# Altium project STM32L0_USB_TempSensor.PrjPcb
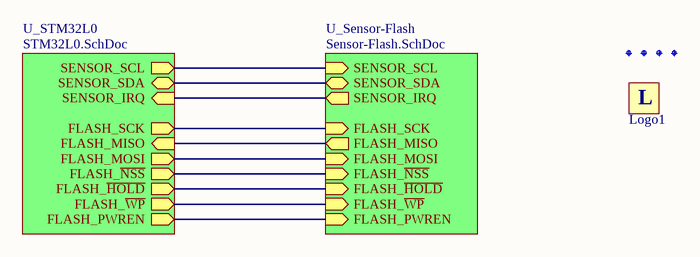
[diagram p0: STM32L0_USB_TempSensor.SchDoc]
3 sheets, 42 parts. Net scope: hierarchical (ports join the sheet entries above them; power ports are global).
Board file: STM32L0_USB_TempSensor.PcbDoc
Sheets:
  STM32L0_USB_TempSensor.SchDoc
    U_STM32L0 = STM32L0.SchDoc
    U_Sensor-Flash = Sensor-Flash.SchDoc

## Sheet STM32L0_USB_TempSensor.SchDoc: Block Diagram
size A4; SheetNumber: 1; SheetTotal: 3; SheetSize: A4

### Parts
Fid1  Fiducial mark  [Fiducial]  (value not drawn)  (no BOM)
Fid2  Fiducial mark  [Fiducial]  (value not drawn)  (no BOM)
Fid3  Fiducial mark  [Fiducial]  (value not drawn)  (no BOM)
Fid4  Fiducial mark  [Fiducial]  (value not drawn)  (no BOM)
Logo1  Logo symbol  [LOGO_YILDIZIOT]  (value not drawn)  (no BOM)

### Sub-sheets
U_Sensor-Flash = Sensor-Flash.SchDoc: FLASH_~{NSS} (in), FLASH_SCK (in), FLASH_MISO (out), FLASH_MOSI (in), FLASH_~{HOLD} (in), FLASH_~{WP} (in), SENSOR_SCL (in), SENSOR_SDA (bidir), SENSOR_IRQ (out), FLASH_PWREN (in)
U_STM32L0 = STM32L0.SchDoc: SENSOR_SCL (out), SENSOR_SDA (bidir), FLASH_~{NSS} (out), FLASH_SCK (out), FLASH_MISO (in), FLASH_MOSI (out), FLASH_~{HOLD} (out), FLASH_~{WP} (out), SENSOR_IRQ (in), FLASH_PWREN (out)

### Nets
NetIC1_1: sheet U_STM32L0/SENSOR_SCL, sheet U_Sensor-Flash/SENSOR_SCL
NetIC1_2: sheet U_STM32L0/SENSOR_IRQ, sheet U_Sensor-Flash/SENSOR_IRQ
NetIC1_6: sheet U_STM32L0/SENSOR_SDA, sheet U_Sensor-Flash/SENSOR_SDA
NetIC2_1: sheet U_STM32L0/FLASH_~{NSS}, sheet U_Sensor-Flash/FLASH_~{NSS}
NetIC2_2: sheet U_STM32L0/FLASH_MISO, sheet U_Sensor-Flash/FLASH_MISO
NetIC2_3: sheet U_STM32L0/FLASH_~{WP}, sheet U_Sensor-Flash/FLASH_~{WP}
NetIC2_5: sheet U_STM32L0/FLASH_MOSI, sheet U_Sensor-Flash/FLASH_MOSI
NetIC2_6: sheet U_STM32L0/FLASH_SCK, sheet U_Sensor-Flash/FLASH_SCK
NetIC2_7: sheet U_STM32L0/FLASH_~{HOLD}, sheet U_Sensor-Flash/FLASH_~{HOLD}
NetIC3_1: sheet U_STM32L0/FLASH_PWREN, sheet U_Sensor-Flash/FLASH_PWREN

### Notes on the sheet
- Title:
- Size:
- Project:
- Revision:
- Sheet
- of
- Date:
- YıLDıZ IoT
- Elperek Mahallesi
- Saray Sokak, No:12
- SAKARYA / TURKEY
- File:
- (in symbol Logo) L

### Library data of the parts
Fid1-Fid4 = Fiducial: Part Number: Fid-Mark; Artikkelnr Noca: N.A.; Manufacturer: *; Manufacturer Part Number: *; Datasheet: *; LatestRevisionDate: 2009-12-12; Pin Count: 1; Publisher: Nordic Semiconductor; Published: 2009-12-12; Value: *; Note: *; Supplier: *; Supplier part number: *; 2nd source Supplier: *; 2nd source part number: *; Footprint Doc: Fiducial; Artikkelnr Simpro: N.A.
Logo1 = Logo: Schematic symbol for Logo

## Sheet STM32L0.SchDoc: MCU
size A4; SheetNumber: 2; SheetTotal: 3; SheetSize: A4
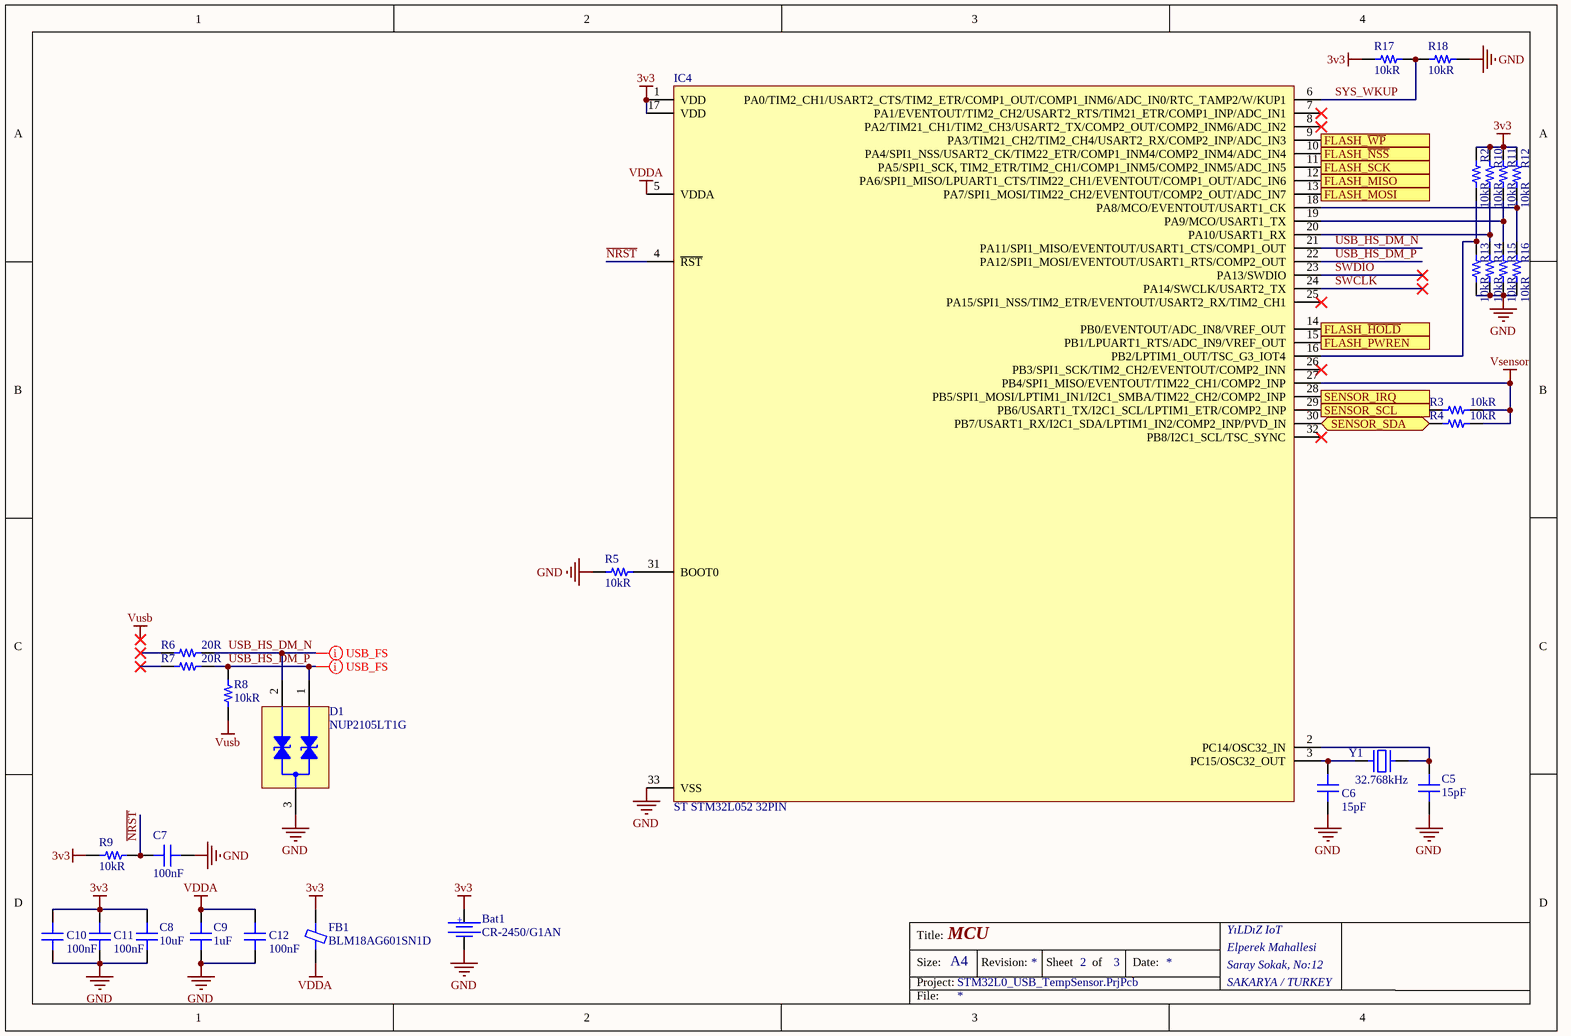
[diagram p1: STM32L0.SchDoc]

### Parts
Bat1  CR-2450/G1AN  [CR-2450/G1AN]
C5  15pF  [CAP 0603/1608]
C6  15pF  [CAP 0603/1608]
C7  100nF  [CAP 0603/1608]
C8  10uF  [CAP 0603/1608]
C9  1uF  [CAP 0603/1608]
C10  100nF  [CAP 0603/1608]
C11  100nF  [CAP 0603/1608]
C12  100nF  [CAP 0603/1608]
D1  NUP2105LT1G  [ON SEMI SOT-23-3]  (no BOM)
FB1  BLM18AG601SN1D  [FER 0603/1608]
IC4  ST STM32L052 32PIN  [ST VFQFN-33 5x5mm]
R2  10kR  [RES 0603/1608]
R3  10kR  [RES 0603/1608]
R4  10kR  [RES 0603/1608]
R5  10kR  [RES 0603/1608]
R6  20R  [RES 0603/1608]
R7  20R  [RES 0603/1608]
R8  10kR  [RES 0603/1608]
R9  10kR  [RES 0603/1608]
R10  10kR  [RES 0603/1608]
R11  10kR  [RES 0603/1608]
R12  10kR  [RES 0603/1608]
R13  10kR  [RES 0603/1608]
R14  10kR  [RES 0603/1608]
R15  10kR  [RES 0603/1608]
R16  10kR  [RES 0603/1608]
R17  10kR  [RES 0603/1608]
R18  10kR  [RES 0603/1608]
Y1  32.768kHz  [ABRACON ABS06]

### Ports
FLASH_MISO (in), FLASH_MOSI (out), FLASH_PWREN (out), FLASH_SCK (out), FLASH_~{HOLD} (out), FLASH_~{NSS} (out), FLASH_~{WP} (out), SENSOR_IRQ (in), SENSOR_SCL (out), SENSOR_SDA (bidir)

### Nets
3v3: Bat1.1 C8.2 C10.2 C11.2 FB1.2 IC4.1(VDD) IC4.17(VDD) R2.1 R9.2 R10.1 R11.1 R12.1 R17.1
GND: Bat1.2 C5.1 C6.1 C7.1 C8.1 C9.1 C10.1 C11.1 C12.1 D1.3(I/O_2) IC4.33(VSS) R5.1 R13.2 R14.2 R15.2 R16.2 R18.2
VDDA: C9.2 C12.2 FB1.1 IC4.5(VDDA)
Vsensor: IC4.27(PB4/SPI1_MISO/EVENTOUT/TIM22_CH1/COMP2_INP) R3.1 R4.1
Vusb: R8.1
~{NRST}: C7.2 IC4.4(~{RST}) R9.1
SWCLK: IC4.24(PA14/SWCLK/USART2_TX)
SWDIO: IC4.23(PA13/SWDIO)
SYS_WKUP: IC4.6(PA0/TIM2_CH1/USART2_CTS/TIM2_ETR/COMP1_OUT/COMP1_INM6/ADC_IN0/RTC_TAMP2/W/KUP1) R17.2 R18.1
USB_HS_DM_N: D1.2(GND) IC4.21(PA11/SPI1_MISO/EVENTOUT/USART1_CTS/COMP1_OUT) R6.1
USB_HS_DM_P: D1.1(I/O_1) IC4.22(PA12/SPI1_MOSI/EVENTOUT/USART1_RTS/COMP2_OUT) R7.1 R8.2
NetC5_2: C5.2 IC4.2(PC14/OSC32_IN) Y1.2
NetC6_2: C6.2 IC4.3(PC15/OSC32_OUT) Y1.1
NetIC1_1: IC4.29(PB6/USART1_TX/I2C1_SCL/LPTIM1_ETR/COMP2_INP) R3.2 ; port SENSOR_SCL
NetIC1_2: IC4.28(PB5/SPI1_MOSI/LPTIM1_IN1/I2C1_SMBA/TIM22_CH2/COMP2_INP) ; port SENSOR_IRQ
NetIC1_6: IC4.30(PB7/USART1_RX/I2C1_SDA/LPTIM1_IN2/COMP2_INP/PVD_IN) R4.2 ; port SENSOR_SDA
NetIC2_1: IC4.10(PA4/SPI1_NSS/USART2_CK/TIM22_ETR/COMP1_INM4/COMP2_INM4/ADC_IN4) ; port FLASH_~{NSS}
NetIC2_2: IC4.12(PA6/SPI1_MISO/LPUART1_CTS/TIM22_CH1/EVENTOUT/COMP1_OUT/ADC_IN6) ; port FLASH_MISO
NetIC2_3: IC4.9(PA3/TIM21_CH2/TIM2_CH4/USART2_RX/COMP2_INP/ADC_IN3) ; port FLASH_~{WP}
NetIC2_5: IC4.13(PA7/SPI1_MOSI/TIM22_CH2/EVENTOUT/COMP2_OUT/ADC_IN7) ; port FLASH_MOSI
NetIC2_6: IC4.11(PA5/SPI1_SCK,_TIM2_ETR/TIM2_CH1/COMP1_INM5/COMP2_INM5/ADC_IN5) ; port FLASH_SCK
NetIC2_7: IC4.14(PB0/EVENTOUT/ADC_IN8/VREF_OUT) ; port FLASH_~{HOLD}
NetIC3_1: IC4.15(PB1/LPUART1_RTS/ADC_IN9/VREF_OUT) ; port FLASH_PWREN
NetIC4_16: IC4.16(PB2/LPTIM1_OUT/TSC_G3_IOT4) R2.2 R13.1
NetIC4_18: IC4.18(PA8/MCO/EVENTOUT/USART1_CK) R12.2 R16.1
NetIC4_19: IC4.19(PA9/MCO/USART1_TX) R11.2 R15.1
NetIC4_20: IC4.20(PA10/USART1_RX) R10.2 R14.1
NetIC4_31: IC4.31(BOOT0) R5.2

Not connected (* = marked no-connect by the designer): IC4 7(PA1/EVENTOUT/TIM2_CH2/USART2_RTS/TIM21_ETR/COMP1_INP/ADC_IN1)* 8(PA2/TIM21_CH1/TIM2_CH3/USART2_TX/COMP2_OUT/COMP2_INM6/ADC_IN2)* 25(PA15/SPI1_NSS/TIM2_ETR/EVENTOUT/USART2_RX/TIM2_CH1)* 26(PB3/SPI1_SCK/TIM2_CH2/EVENTOUT/COMP2_INN)* 32(PB8/I2C1_SCL/TSC_SYNC)*; R6 2*; R7 2*

### Layout directives
differential pair; differential pair class USB_FS; rule Differential Pairs Routing [Pref Gap = 0.254mm    Min Gap  = 0.127mm    Max Gap  = 0.254mmPref Width = 0.127mm    Min Width  = 0.127mm    Max Width  = 0.381mm]; rule Matched Net Lengths [Tolerance = 100mil]: USB_HS_DM_N, USB_HS_DM_P

### Notes on the sheet
- Labels drawn without touching a wire or pin: Vusb
- Title:
- Size:
- Project:
- Revision:
- Sheet
- of
- Date:
- YıLDıZ IoT
- Elperek Mahallesi
- Saray Sokak, No:12
- SAKARYA / TURKEY
- File:
- (in symbol Battery) +

### Library data of the parts
Bat1 = Battery: Bat Holder; Manufacturer: Panasonic BSG; Output Voltage: 3V; Capacity: 620mAh; Chemistry/Technology: Lithium; Number of Cells: 1; Supplier 1: Digi-Key; Supplier Part Number 1: P661-ND; Manufacturer Part Number: CR-2450/G1AN; Stock 1: 10737; Pricing 1: 1 = 1,76000, 20 = 1,46300, 40 = 1,35975, 100 = 1,21560, 300 = 1,13323, 500 = 1,07140, 1000 = 1,00960, 2500 = 0,94092 (USD); RoHS: Yes; Mount: Through Hole; Weight: 6.3g; Contact Plating: Tin; Min Operating Temperature: -30°C; Max Operating Temperature: 60°C; Termination: PC Pin; Package Quantity: 200; Orientation: Horizontal; Packaging: Bulk; Voltage Rating: 3V; Diameter: 24.5mm; Length: 24.6mm; Height: 5mm; Depth: 24.6mm; Lead Free: Lead Free; ComponentLink1URL: https://datasheet.ciiva.com/2/aaa4000de105-2936.pdf?src-supplier=Digi-Key; ComponentLink1Description: https://datasheet.ciiva.com/2/aaa4000de105-2936.pdf?src-supplier=Digi-Key; ComponentLink2URL: https://datasheet.ciiva.com/24073/aaa4000de105-259051-24073605.pdf?src-supplier=Mouser; ComponentLink2Description: https://datasheet.ciiva.com/24073/aaa4000de105-259051-24073605.pdf?src-supplier=Mouser
C5 C6 = Capacitor - Ceramic: Ceramic, SMT Capacitor; Manufacturer: Walsin Technologies; Manufacturer Part Number: 0603N150J500CT; Tolerance: 5%; Dielectric: C0G; Voltage Rating: 50V; Supplier 1: Digi-Key; Supplier Part Number 1: 1292-1487-1-ND; Stock 1: 219118; Pricing 1: 1 = 0,10000, 10 = 0,03300, 100 = 0,01490, 500 = 0,01062, 1000 = 0,00835 (USD); RoHS: Yes; Case/Package: 0603; Case Code (Metric): 1608; Case Code (Imperial): 0603; Min Operating Temperature: -55°C; Max Operating Temperature: 125°C; Packaging: Tape and Reel; Capacitance: 15pF; Voltage Rating (DC): 50V; Length: 1.6mm; Depth: 0.8mm; REACH SVHC: Unknown; ComponentLink1URL: http://www.farnell.com/datasheets/1958513.pdf?src-supplier=Farnell; ComponentLink1Description: http://www.farnell.com/datasheets/1958513.pdf?src-supplier=Farnell; ComponentLink2URL: http://www.farnell.com/datasheets/2340522.pdf?src-supplier=Farnell; ComponentLink2Description: http://www.farnell.com/datasheets/2340522.pdf?src-supplier=Farnell; ComponentLink3URL: http://components.arrow.com/part/dataview/0323_03468609?src-supplier=Arrow+Europe; ComponentLink3Description: http://components.arrow.com/part/dataview/0323_03468609?src-supplier=Arrow+Europe; ComponentLink4URL: http://www.farnell.com/datasheets/1958513.pdf?src-supplier=Element14; ComponentLink4Description: http://www.farnell.com/datasheets/1958513.pdf?src-supplier=Element14
C7 C10-C12 = Capacitor - Ceramic: Ceramic, SMT Capacitor; Manufacturer: Samsung; Manufacturer Part Number: CL10B104JB8NNNC; Tolerance: 5%; Voltage Rating: 50V; Dielectric: X7R; Supplier 1: Digi-Key; Supplier Part Number 1: 1276-1033-1-ND; Stock 1: 223594; Pricing 1: 1 = 0,10000, 10 = 0,05300, 100 = 0,02350, 500 = 0,01680, 1000 = 0,01320 (USD); RoHS: Yes; Mount: Surface Mount; Case/Package: 0603; Case Code (Metric): 1608; Case Code (Imperial): 0603; Material: Ceramic; Contact Plating: Tin; Min Operating Temperature: -55°C; Max Operating Temperature: 125°C; Packaging: Tape and Reel; Package Quantity: 1; Capacitance: 100nF; Voltage: 50V; Length: 1.6mm; Height: 0.8mm; Width: 0.031inch; Thickness: 0.035inch; Depth: 0.8mm; Radiation Hardening: No; ComponentLink1URL: https://media.digikey.com/pdf/Data%20Sheets/Samsung%20PDFs/CL_Series_MLCC_ds.pdf?src-supplier=Digi-Key; ComponentLink1Description: https://media.digikey.com/pdf/Data%20Sheets/Samsung%20PDFs/CL_Series_MLCC_ds.pdf?src-supplier=Digi-Key; ComponentLink2URL: https://www.verical.com/server-webapp/html/getDatasheet?partID=359321&src-supplier=Verical; ComponentLink2Description: https://www.verical.com/server-webapp/html/getDatasheet?partID=359321&src-supplier=Verical; ComponentLink3URL: http://www1.futureelectronics.com/doc/SAMSUNG/CL10B104JB8NNNC.pdf?src-supplier=Future+Electronics; ComponentLink3Description: http://www1.futureelectronics.com/doc/SAMSUNG/CL10B104JB8NNNC.pdf?src-supplier=Future+Electronics; ComponentLink4URL: https://produktinfo.conrad.com/datenblaetter/450000-474999/456613-da-01-en-VS_KONDENSATOR_0603.pdf?src-supplier=Conrad; ComponentLink4Description: https://produktinfo.conrad.com/datenblaetter/450000-474999/456613-da-01-en-VS_KONDENSATOR_0603.pdf?src-supplier=Conrad
C8 = Capacitor - Ceramic: Ceramic, SMT Capacitor; Manufacturer: Kyocera AVX; Manufacturer Part Number: 0603ZD106KAT2A; Dielectric: X5R; Voltage Rating (DC): 10V; Tolerance: 10%; ComponentLink1URL: https://datasheet.ciiva.com/25713/cl10a475mq8nnnc-25713301.pdf?src-supplier=Digi-Key; ComponentLink1Description: https://datasheet.ciiva.com/25713/cl10a475mq8nnnc-25713301.pdf?src-supplier=Digi-Key; ComponentLink2URL: https://datasheet.ciiva.com/26838/getdatasheetpartid-358407-26838391.pdf?src-supplier=Verical; ComponentLink2Description: https://datasheet.ciiva.com/26838/getdatasheetpartid-358407-26838391.pdf?src-supplier=Verical; ComponentLink3URL: https://datasheet.ciiva.com/16437/cl05b104kq5nnnc-16437323.pdf?src-supplier=Future+Electronics; ComponentLink3Description: https://datasheet.ciiva.com/16437/cl05b104kq5nnnc-16437323.pdf?src-supplier=Future+Electronics; Supplier 1: Digi-Key; Supplier Part Number 1: 478-10766-1-ND; Stock 1: 32713; Pricing 1: 1 = 0,13000, 10 = 0,09200 (USD); RoHS: No; Case/Package: 0603; Capacitance: 10uF; ComponentLink4URL: http://datasheets.avx.com/cx5r.pdf?src-supplier=Digi-Key; ComponentLink4Description: http://datasheets.avx.com/cx5r.pdf?src-supplier=Digi-Key
C9 = Capacitor - Ceramic: Ceramic, SMT Capacitor; Manufacturer: Samsung; Manufacturer Part Number: CL10A105KP8NNNC; Tolerance: 10%; Voltage Rating: 10V; Dielectric: X5R; Supplier 1: Digi-Key; Supplier Part Number 1: 1276-1182-1-ND; Stock 1: 4590831; Pricing 1: 1 = 0,10000, 10 = 0,03800, 100 = 0,01680, 500 = 0,01200, 1000 = 0,00943 (USD); RoHS: Yes; Mount: Surface Mount; Case/Package: 0603; Case Code (Metric): 1608; Case Code (Imperial): 0603; Contact Plating: Tin; Min Operating Temperature: -55°C; Max Operating Temperature: 85°C; Packaging: Tape and Reel; Package Quantity: 1; Capacitance: 1uF; Voltage: 10V; Length: 1.6mm; Height: 0.8mm; Width: 0.031inch; Thickness: 0.035inch; Depth: 0.8mm; Radiation Hardening: No; ComponentLink1URL: https://datasheet.ciiva.com/15195/getdatasheetpartid-358616-15195708.pdf?src-supplier=Verical; ComponentLink1Description: https://datasheet.ciiva.com/15195/getdatasheetpartid-358616-15195708.pdf?src-supplier=Verical; ComponentLink2URL: https://datasheet.ciiva.com/16358/cl05b104kq5nnnc-16358431.pdf?src-supplier=Future+Electronics; ComponentLink2Description: https://datasheet.ciiva.com/16358/cl05b104kq5nnnc-16358431.pdf?src-supplier=Future+Electronics
D1 = NUP2105LT1G: TVS DIODE 24V 44V SOT23-3; Manufacturer: ON Semiconductor; Bidirectional Channels: 2; Capacitance @ Frequency: 30pF @ 1MHz; Current - Peak Pulse (10/1000µs): 8A (8/20µs); Power Line Protection: No; Power - Peak Pulse: 350W; Type: Zener; Voltage - Breakdown (Min): 26.2V; Voltage - Reverse Standoff (Typ): 24V (Min); Manufacturer Part Number: NUP2105LT1G; Applications: General Purpose; ComponentLink1Description: Datasheet; ComponentLink1URL: http://www.onsemi.com/pub/Collateral/NUP2105L-D.PDF; ComponentLink2Description: DigiKey Link; ComponentLink2URL: http://digikey.com/product-detail/en/on-semiconductor/NUP2105LT1G/NUP2105LT1GOSCT-ND/1485001; Device Package: TO-236-3, SC-59, SOT-23-3; LastUpdated: 30.03.2020 16:33:57; Lifecycle Status: Active; Minimum Order: 1; Mounting Type: Surface Mount; Operating Temperature: -55°C ~ 150°C (TJ); Package / Case: TO-236-3, SC-59, SOT-23-3; Packaging: TapeAndReel; PartId: 10506; Part Status: Active; Price: 0.09; Series: -; Supplier 1: DigiKey; Supplier Part Number 1: NUP2105LT1GOSCT-ND; Supplier Device Package: SOT-23-3 (TO-236); Voltage - Clamping (Max) @ Ipp: 44V
FB1 = Ferrite Chip: SMT Ferrite Chip; Manufacturer: Murata; Material: Steel; Frequency: 100MHz; Tolerance: 25%; Impedance: 600R; Max Current Rating: 500mA; Number of Lines: 1; DC Resistance (DCR): 380mR; Shielding: Unshielded; Supplier 1: Digi-Key; Supplier Part Number 1: 490-1014-1-ND; Manufacturer Part Number: BLM18AG601SN1D; Stock 1: 1151376; Pricing 1: 1 = 0,10000, 10 = 0,07900, 25 = 0,07200, 50 = 0,06480, 100 = 0,04760, 250 = 0,03460, 500 = 0,03170, 1000 = 0,02738 (USD); RoHS: Yes; Case/Package: 0603; Number of Pins: 2; Weight: 7.1E-05oz; Core Material: Ferrite; Case Code (Metric): 1608; Case Code (Imperial): 0603; Min Operating Temperature: -55°C; Max Operating Temperature: 125°C; Package Quantity: 1; Packaging: Tape and Reel; Current Rating: 500mA; Termination: SMD/SMT; Max DC Current: 500mA; Test Frequency: 100MHz; DC Current: 500mA; Military Standard: Not; Number of Circuits: 1; Length: 1.6mm; Height: 0.8mm; Width: 0.8mm; Depth: 0.8mm; Radiation Hardening: No; Lead Free: Lead Free; REACH SVHC: No SVHC; ComponentLink1URL: https://datasheet.ciiva.com/19460/1844766-19460213.pdf?src-supplier=Jameco; ComponentLink1Description: https://datasheet.ciiva.com/19460/1844766-19460213.pdf?src-supplier=Jameco; ComponentLink2URL: https://datasheet.ciiva.com/29347/442309-da-01-en-chip-drossel-0603-600r-500ma-1-6x0-8mm-29347900.pdf?src-supplier=Conrad; ComponentLink2Description: https://datasheet.ciiva.com/29347/442309-da-01-en-chip-drossel-0603-600r-500ma-1-6x0-8mm-29347900.pdf?src-supplier=Conrad; ComponentLink3URL: https://datasheet.ciiva.com/41449/001172228-da-01-en-drossel-0603-600r-1-6x0-8mm-4000st-41449517.pdf?src-supplier=Conrad; ComponentLink3Description: https://datasheet.ciiva.com/41449/001172228-da-01-en-drossel-0603-600r-1-6x0-8mm-4000st-41449517.pdf?src-supplier=Conrad; ComponentLink4URL: https://datasheet.ciiva.com/1012/l0110s0100blm18a-1012018.pdf?src-supplier=Digi-Key; ComponentLink4Description: https://datasheet.ciiva.com/1012/l0110s0100blm18a-1012018.pdf?src-supplier=Digi-Key; ComponentLink5URL: https://datasheet.ciiva.com/1012/l0110s0100blm18a-1012019.pdf?src-supplier=Digi-Key; ComponentLink5Description: https://datasheet.ciiva.com/1012/l0110s0100blm18a-1012019.pdf?src-supplier=Digi-Key; ComponentLink6URL: https://datasheet.ciiva.com/1466/1756147-1466934.pdf?src-supplier=Element14; ComponentLink6Description: https://datasheet.ciiva.com/1466/1756147-1466934.pdf?src-supplier=Element14; ComponentLink7URL: https://datasheet.ciiva.com/3081/l0110s0100blm18a-3081613.pdf?src-supplier=Avnet; ComponentLink7Description: https://datasheet.ciiva.com/3081/l0110s0100blm18a-3081613.pdf?src-supplier=Avnet; ComponentLink8URL: https://datasheet.ciiva.com/1012/l0110s0100blm18a-1012017.pdf?src-supplier=Digi-Key; ComponentLink8Description: https://datasheet.ciiva.com/1012/l0110s0100blm18a-1012017.pdf?src-supplier=Digi-Key; ComponentLink9URL: https://datasheet.ciiva.com/1466/1756147-1466933.pdf?src-supplier=Element14; ComponentLink9Description: https://datasheet.ciiva.com/1466/1756147-1466933.pdf?src-supplier=Element14; ComponentLink10URL: https://datasheet.ciiva.com/16210/l0110s0100blm18a-16210006.pdf?src-supplier=Future+Electronics; ComponentLink10Description: https://datasheet.ciiva.com/16210/l0110s0100blm18a-16210006.pdf?src-supplier=Future+Electronics
IC4 = ST STM32L052 32PIN: Manufacturer: STMicroelectronics; Manufacturer Part Number: STM32L052K6U6; Frequency: 32MHz; Oscillator Type: Internal; Data Bus Width: 32b; Number of Programmable I/O: 27; Watchdog Timer: Yes; Peripherals: Brown-out Detect/Reset,POR,PWM,WDT,DMA; Memory Type: FLASH; Memory Size: 32KB; RAM Size: 8KB; Max Power Dissipation: 351mW; Interface: I2C,SPI,USB,IrDA,UART,USART,I2S; Number of Timers/Counters: 5; Core Architecture: ARM; Supplier 1: Digi-Key; Supplier Part Number 1: 497-17492-ND; Stock 1: 1850; Pricing 1: 1 = 3,25000, 10 = 2,91800, 25 = 2,75840, 100 = 2,39070, 250 = 2,26812, 500 = 2,03516, 1000 = 1,71640, 2500 = 1,63058, 5000 = 1,56928 (USD); RoHS: Yes; Case/Package: UFQFPN; Min Operating Temperature: -40°C; Max Operating Temperature: 85°C; Max Frequency: 32MHz; Package Quantity: 2940; Packaging: Tray; Number of I/Os: 27; ComponentLink1URL: https://datasheet.ciiva.com/48492/dm00108217-48492190.pdf?src-supplier=Avnet; ComponentLink1Description: https://datasheet.ciiva.com/48492/dm00108217-48492190.pdf?src-supplier=Avnet
R2-R5 R8-R18 = Resistor_Chip: Ceramic, SMT Capacitor; Manufacturer: Stackpole Electronics; Manufacturer Part Number: RNCP0603FTD10K0; Tolerance: 1%; Max Power Dissipation: 125mW; Temperature Coefficient: 100ppm/°C; Supplier 1: Digi-Key; Supplier Part Number 1: RNCP0603FTD10K0CT-ND; Stock 1: 183083; Pricing 1: 1 = 0,10000, 10 = 0,06700, 100 = 0,02730, 1000 = 0,01224, 2500 = 0,01063 (USD); RoHS: Yes; Mount: Surface Mount; Case/Package: 0603; Case Code (Metric): 1608; Case Code (Imperial): 0603; Contact Plating: Matte,Tin; Min Operating Temperature: -55°C; Max Operating Temperature: 155°C; Packaging: Tape and Reel; Resistance: 10kR; Composition: Thin Film; Number of Terminations: 2; Features: Anti-Sulfur,Moisture Resistant; Length: 0.059inch; Height: 0.02inch; Width: 0.031inch; Radiation Hardening: No; Lead Free: Lead Free
R6 R7 = Resistor_Chip: Ceramic, SMT Capacitor; Manufacturer: Panasonic; Manufacturer Part Number: ERJ3EKF20R0V; Power Rating: 100mW; Tolerance: 1%; Voltage Rating: 75V; Temperature Coefficient: 100ppm/°C; Voltage Rating (DC): 50V; Supplier 1: Digi-Key; Supplier Part Number 1: P20.0HCT-ND; Stock 1: 1013618; Pricing 1: 1 = 0,10000, 10 = 0,06500, 100 = 0,02640, 1000 = 0,01186, 2500 = 0,01029 (USD); RoHS: Yes; Mount: Surface Mount; Case/Package: 0603; Case Code (Metric): 1608; Case Code (Imperial): 0603; Contact Plating: Tin; Min Operating Temperature: -55°C; Max Operating Temperature: 155°C; Packaging: Tape and Reel; Resistance: 20R; Package Quantity: 1; Composition: Thick Film; Number of Terminations: 2; Termination: SMD/SMT; Military Standard: Not; Max Power Dissipation: 100mW; Features: Automotive AEC-Q200; Length: 1.6mm; Height: 0.45mm; Width: 0.031inch; Depth: 0.8mm; Radiation Hardening: No; REACH SVHC: No SVHC; Lead Free: Lead Free; ComponentLink1URL: http://industrial.panasonic.com/www-data/pdf/AOA0000/AOA0000CE2.pdf; ComponentLink1Description: http://industrial.panasonic.com/www-data/pdf/AOA0000/AOA0000CE2.pdf; ComponentLink2URL: https://www.alliedelec.com/m/d/623f45ff1957d936ff56d46fd1c28cac.pdf; ComponentLink2Description: https://www.alliedelec.com/m/d/623f45ff1957d936ff56d46fd1c28cac.pdf; ComponentLink3URL: http://www.jameco.com/Jameco/Products/ProdDS/1987732.pdf; ComponentLink3Description: http://www.jameco.com/Jameco/Products/ProdDS/1987732.pdf; ComponentLink4URL: http://www.farnell.com/datasheets/1678782.pdf; ComponentLink4Description: http://www.farnell.com/datasheets/1678782.pdf; ComponentLink5URL: http://www.farnell.com/datasheets/1911175.pdf; ComponentLink5Description: http://www.farnell.com/datasheets/1911175.pdf; ComponentLink6URL: http://www.mouser.com/ds/2/315/AOA0000CE2-37512.pdf; ComponentLink6Description: http://www.mouser.com/ds/2/315/AOA0000CE2-37512.pdf
Y1 = ABS06-32.768KHZ-1-T: CRYSTAL 32.7680KHZ 12.5PF SMD; Manufacturer: Abracon LLC; Frequency Tolerance: 10ppm; ESR: 90 kOhm; Operating Mode: Fundamental; ESR (Equivalent Series Resistance): 90kR; Manufacturer Part Number: ABS06-32.768KHZ-1-T; PartId: 8532; Supplier 1: Digi-Key; ComponentLink1Description: Datasheet; ComponentLink1URL: http://www.abracon.com/Resonators/ABS06.pdf; ComponentLink2Description: Digi-Key Listing; ComponentLink2URL: http://www.digikey.com/product-detail/en/ABS06-32.768KHZ-1-T/535-10248-2-ND/2217994; Type: kHz Crystal (Tuning Fork); Device Package: 2-SMD; Frequency: 32.768kHz; Frequency Stability: -; Load Capacitance: 12.5pF; Supplier Part Number 1: 535-10248-1-ND; Stock 2: 63513; Pricing 1: 1 = 0,80000, 10 = 0,70800, 50 = 0,66220, 100 = 0,58520, 500 = 0,55440, 1000 = 0,46200 (USD); RoHS: Yes; Mount: Surface Mount; Case/Package: CSMD; Number of Pins: 2; Min Operating Temperature: -40°C; Max Operating Temperature: 85°C; Tolerance: 10ppm; Packaging: Tape and Reel; Package Quantity: 3000; Termination: SMD/SMT; Series Resistance: 90kR; Length: 2mm; Height: 0.024inch; Width: 1.2mm; Depth: 1.2mm; Radiation Hardening: No; REACH SVHC: No SVHC; Lead Free: Lead Free; ComponentLink3URL: https://datasheet.ciiva.com/15116/getdatasheetpartid-721079-15116832.pdf?src-supplier=Verical; ComponentLink3Description: https://datasheet.ciiva.com/15116/getdatasheetpartid-721079-15116832.pdf?src-supplier=Verical; ComponentLink4URL: https://datasheet.ciiva.com/7998/abs06-7998658.pdf?src-supplier=Element14; ComponentLink4Description: https://datasheet.ciiva.com/7998/abs06-7998658.pdf?src-supplier=Element14; ComponentLink5URL: https://datasheet.ciiva.com/1357/1796520-1357315.pdf?src-supplier=Element14; ComponentLink5Description: https://datasheet.ciiva.com/1357/1796520-1357315.pdf?src-supplier=Element14; ComponentLink6URL: https://datasheet.ciiva.com/28508/1912788-28508597.pdf?src-supplier=Element14; ComponentLink6Description: https://datasheet.ciiva.com/28508/1912788-28508597.pdf?src-supplier=Element14; ComponentLink7URL: https://datasheet.ciiva.com/856/abs06-856604.pdf?src-supplier=Digi-Key; ComponentLink7Description: https://datasheet.ciiva.com/856/abs06-856604.pdf?src-supplier=Digi-Key; ComponentLink8URL: https://datasheet.ciiva.com/3176/abs06-3176156.pdf?src-supplier=Avnet; ComponentLink8Description: https://datasheet.ciiva.com/3176/abs06-3176156.pdf?src-supplier=Avnet; ComponentLink9URL: https://datasheet.ciiva.com/856/abs06-856605.pdf?src-supplier=Digi-Key; ComponentLink9Description: https://datasheet.ciiva.com/856/abs06-856605.pdf?src-supplier=Digi-Key; ComponentLink10URL: https://datasheet.ciiva.com/856/abs06-856606.pdf?src-supplier=Digi-Key; ComponentLink10Description: https://datasheet.ciiva.com/856/abs06-856606.pdf?src-supplier=Digi-Key

## Sheet Sensor-Flash.SchDoc: Sensor & Flash
size A4; SheetNumber: 3; SheetTotal: 3; SheetSize: A4
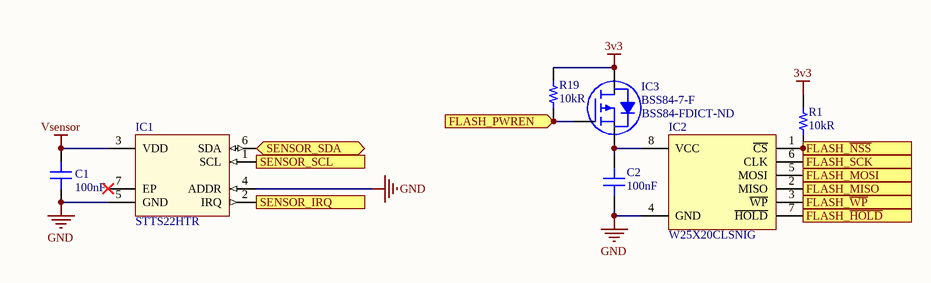
[diagram p2: Sensor-Flash.SchDoc]

### Parts
C1  100nF  [CAP 0603/1608]
C2  100nF  [CAP 0603/1608]
IC1  STTS22HTR  [ST UDFN-6 2x2x0.5]
IC2  W25X20CLSNIG  [WINBOND SOIC-8 208MIL WIDE]
IC3  BSS84-7-F  Supplier Part Number 1: BSS84-FDICT-ND  [DIODES SOT-23-3]
R1  10kR  [RES 0603/1608]
R19  10kR  [RES 0603/1608]

### Ports
FLASH_MISO (out), FLASH_MOSI (in), FLASH_PWREN (in), FLASH_SCK (in), FLASH_~{HOLD} (in), FLASH_~{NSS} (in), FLASH_~{WP} (in), SENSOR_IRQ (out), SENSOR_SCL (in), SENSOR_SDA (bidir)

### Nets
3v3: IC3.3(D) R1.2 R19.2
GND: C1.1 C2.2 IC1.4(ADDR) IC1.5(GND) IC2.4(GND)
Vsensor: C1.2 IC1.3(VDD)
NetC2_1: C2.1 IC2.8(VCC) IC3.2(S)
NetIC1_1: IC1.1(SCL) ; port SENSOR_SCL
NetIC1_2: IC1.2(IRQ) ; port SENSOR_IRQ
NetIC1_6: IC1.6(SDA) ; port SENSOR_SDA
NetIC2_1: IC2.1(~{CS}) R1.1 ; port FLASH_~{NSS}
NetIC2_2: IC2.2(MISO) ; port FLASH_MISO
NetIC2_3: IC2.3(~{WP}) ; port FLASH_~{WP}
NetIC2_5: IC2.5(MOSI) ; port FLASH_MOSI
NetIC2_6: IC2.6(CLK) ; port FLASH_SCK
NetIC2_7: IC2.7(~{HOLD}) ; port FLASH_~{HOLD}
NetIC3_1: IC3.1(G) R19.1 ; port FLASH_PWREN

Not connected (* = marked no-connect by the designer): IC1 7(EP)*

### Notes on the sheet
- Title:
- Size:
- Project:
- Revision:
- Sheet
- of
- Date:
- YıLDıZ IoT
- Elperek Mahallesi
- Saray Sokak, No:12
- SAKARYA / TURKEY
- File:

### Library data of the parts
C1 C2 = Capacitor - Ceramic: as C7 on sheet STM32L0; Supplier 1: Digi-Key; Supplier Part Number 1: 1276-1033-1-ND; RoHS: Yes; Mount: Surface Mount; Case/Package: 0603; Case Code (Metric): 1608; Case Code (Imperial): 0603; Material: Ceramic; Contact Plating: Tin; Min Operating Temperature: -55°C; Max Operating Temperature: 125°C; Packaging: Tape and Reel; Package Quantity: 1; Capacitance: 100nF; Voltage: 50V; Length: 1.6mm; Height: 0.8mm; Width: 0.031inch; Thickness: 0.035inch; Depth: 0.8mm; Radiation Hardening: No
  C1: Stock 1: 223594; Pricing 1: 1 = 0,10000, 10 = 0,05300, 100 = 0,02350, 500 = 0,01680, 1000 = 0,01320 (USD); ComponentLink1URL: https://media.digikey.com/pdf/Data%20Sheets/Samsung%20PDFs/CL_Series_MLCC_ds.pdf?src-supplier=Digi-Key; ComponentLink1Description: https://media.digikey.com/pdf/Data%20Sheets/Samsung%20PDFs/CL_Series_MLCC_ds.pdf?src-supplier=Digi-Key; ComponentLink2URL: https://www.verical.com/server-webapp/html/getDatasheet?partID=359321&src-supplier=Verical; ComponentLink2Description: https://www.verical.com/server-webapp/html/getDatasheet?partID=359321&src-supplier=Verical; ComponentLink3URL: http://www1.futureelectronics.com/doc/SAMSUNG/CL10B104JB8NNNC.pdf?src-supplier=Future+Electronics; ComponentLink3Description: http://www1.futureelectronics.com/doc/SAMSUNG/CL10B104JB8NNNC.pdf?src-supplier=Future+Electronics; ComponentLink4URL: https://produktinfo.conrad.com/datenblaetter/450000-474999/456613-da-01-en-VS_KONDENSATOR_0603.pdf?src-supplier=Conrad; ComponentLink4Description: https://produktinfo.conrad.com/datenblaetter/450000-474999/456613-da-01-en-VS_KONDENSATOR_0603.pdf?src-supplier=Conrad
  C2: Stock 1: 305374; Pricing 1: 1 = 0,10000, 10 = 0,04800, 100 = 0,02160, 500 = 0,01540, 1000 = 0,01210 (USD); ComponentLink1URL: https://datasheet.ciiva.com/25793/cl10b104jb8nnnc-25793394.pdf?src-supplier=Digi-Key; ComponentLink1Description: https://datasheet.ciiva.com/25793/cl10b104jb8nnnc-25793394.pdf?src-supplier=Digi-Key; ComponentLink2URL: https://datasheet.ciiva.com/26838/getdatasheetpartid-359321-26838402.pdf?src-supplier=Verical; ComponentLink2Description: https://datasheet.ciiva.com/26838/getdatasheetpartid-359321-26838402.pdf?src-supplier=Verical; ComponentLink3URL: https://datasheet.ciiva.com/16498/cl10b104jb8nnnc-16498485.pdf?src-supplier=Future+Electronics; ComponentLink3Description: https://datasheet.ciiva.com/16498/cl10b104jb8nnnc-16498485.pdf?src-supplier=Future+Electronics; ComponentLink4URL: https://datasheet.ciiva.com/29199/456613-da-01-en-vs-kondensator-0603-29199008.pdf?src-supplier=Conrad; ComponentLink4Description: https://datasheet.ciiva.com/29199/456613-da-01-en-vs-kondensator-0603-29199008.pdf?src-supplier=Conrad
IC1 = ST STTS22HTR: Low-voltage, ultra-low-power, 0.5 °C accuracy I²C/SMBus 3.0 temperature sensor; Manufacturer_Name: STMicroelectronics; Datasheet Link: https://www.mouser.com/datasheet/2/389/stts22h-1663205.pdf; Height: 0.55mm; Manufacturer_Part_Number: STTS22HTR; Mouser Part Number: 511-STTS22HTR; Mouser Price/Stock: https://www.mouser.co.uk/ProductDetail/STMicroelectronics/STTS22HTR?qs=%252B6g0mu59x7LCfjXXPvLkpg%3D%3D; RS Part Number: 1947647P; RS Price/Stock: http://uk.rs-online.com/web/p/products/1947647P; Supplier 1: Digi-Key; Supplier Part Number 1: 497-STTS22HCT-ND; Manufacturer: STMicroelectronics; Manufacturer Part Number: STTS22HTR; Stock 1: 5772; Pricing 1: 1 = 1,53000, 10 = 1,37200, 25 = 1,30200, 100 = 1,06950, 250 = 0,99976, 500 = 0,88350, 1000 = 0,69750 (USD); RoHS: No
IC2 = WINBOND FLASH SPI 8PIN: Address Bus Width: 24b; Density: 2Mb; Interface: SPI,Serial; Number of Words: 256000; Max Supply Voltage: 3.6V; Min Supply Voltage: 2.3V; Nominal Supply Current: 14mA; Access Time: 8ns; Memory Type: FLASH; Frequency: 50MHz; Sync/Async: Synchronous; ComponentLink1URL: http://www.winbond.com/resource-files/w25q128jv_dtr%20revc%2003272018%20plus.pdf?src-supplier=Digi-Key; ComponentLink1Description: http://www.winbond.com/resource-files/w25q128jv_dtr%20revc%2003272018%20plus.pdf?src-supplier=Digi-Key; Supplier 1: Digi-Key; Supplier Part Number 1: W25X20CLSNIG-ND; Manufacturer: Winbond; Manufacturer Part Number: W25X20CLSNIG; Stock 1: 12189; Pricing 1: 1 = 0,35000, 10 = 0,34200, 25 = 0,31800, 50 = 0,31600, 100 = 0,28080, 250 = 0,27712, 500 = 0,27298, 1000 = 0,26566, 5000 = 0,23877 (USD); RoHS: Yes; Mount: Surface Mount; Case/Package: SOIC; Number of Pins: 8; Min Operating Temperature: -40°C; Max Operating Temperature: 85°C; Package Quantity: 100; Packaging: Rail/Tube; Radiation Hardening: No; ComponentLink2URL: https://datasheet.ciiva.com/1907/serialflashselectionguide1112911-1907412.pdf?src-supplier=Digi-Key; ComponentLink2Description: https://datasheet.ciiva.com/1907/serialflashselectionguide1112911-1907412.pdf?src-supplier=Digi-Key
IC3 = BSS84-7-F: MOSFET P-CH 50V 130MA SOT23-3; Manufacturer: Diodes; Description: DIODES INC. - BSS84-7-F - MOSFET Transistor, P Channel, 130 mA, -50 V, 10 ohm, -5 V, -800 mV; Input Capacitance: 45pF; Number of Elements: 1; Max Power Dissipation: 300mW; Rds On Max: 10R; Voltage Rating (DC): -50V; Current Rating: -130mA; Element Configuration: Single; Gate to Source Voltage (Vgs): 20V; Turn-Off Delay Time: 18ns; Turn-On Delay Time: 10ns; Threshold Voltage: -800mV; ComponentLink1Description: Datasheet; ComponentLink1URL: https://www.diodes.com/assets/Datasheets/ds30149.pdf; ComponentLink2Description: DigiKey Link; ComponentLink2URL: http://digikey.com/product-detail/en/diodes-incorporated/BSS84-7-F/BSS84-FDICT-ND/717844; Supplier 1: Digi-Key; Manufacturer Part Number: BSS84-7-F; Stock 1: 1235678; Pricing 1: 1 = 0,23000, 10 = 0,19000, 25 = 0,15920, 100 = 0,07780, 250 = 0,07656, 500 = 0,06488, 1000 = 0,04508 (USD); RoHS: Yes; Mount: Surface Mount; Case/Package: SOT-23; Number of Pins: 3; Weight: 0.000282oz; Contact Plating: Tin,Matte; Min Operating Temperature: -55°C; Max Operating Temperature: 150°C; Packaging: Tape and Reel; Package Quantity: 3000; Number of Channels: 1; On-State Resistance: 10R; Power Dissipation: 300mW; Drain to Source Resistance: 10R; Drain to Source Voltage (Vdss): -50V; Continuous Drain Current (ID): 130mA; Length: 2.9mm; Height: 1mm; Width: 1.3mm; Lead Free: Lead Free; REACH SVHC: No SVHC; ComponentLink3URL: https://datasheet.ciiva.com/16221/ds30149-16221984.pdf?src-supplier=Future+Electronics; ComponentLink3Description: https://datasheet.ciiva.com/16221/ds30149-16221984.pdf?src-supplier=Future+Electronics; ComponentLink4URL: https://datasheet.ciiva.com/4442/ds30149-42275-4442950.pdf?src-supplier=Mouser; ComponentLink4Description: https://datasheet.ciiva.com/4442/ds30149-42275-4442950.pdf?src-supplier=Mouser; ComponentLink5URL: https://datasheet.ciiva.com/934/ds30149-934539.pdf?src-supplier=Digi-Key; ComponentLink5Description: https://datasheet.ciiva.com/934/ds30149-934539.pdf?src-supplier=Digi-Key; ComponentLink6URL: https://datasheet.ciiva.com/8115/ds30149-8115403.pdf?src-supplier=Avnet; ComponentLink6Description: https://datasheet.ciiva.com/8115/ds30149-8115403.pdf?src-supplier=Avnet; ComponentLink7URL: https://datasheet.ciiva.com/934/ds30149-934540.pdf?src-supplier=Digi-Key; ComponentLink7Description: https://datasheet.ciiva.com/934/ds30149-934540.pdf?src-supplier=Digi-Key; ComponentLink8URL: https://datasheet.ciiva.com/49020/70437757-49020999.pdf?src-supplier=Allied+Electronics; ComponentLink8Description: https://datasheet.ciiva.com/49020/70437757-49020999.pdf?src-supplier=Allied+Electronics
R1 R19 = Resistor_Chip: as R2 on sheet STM32L0; Supplier 1: Digi-Key; Supplier Part Number 1: RNCP0603FTD10K0CT-ND; Stock 1: 619664; Pricing 1: 1 = 0,10000, 10 = 0,06700, 100 = 0,02730, 1000 = 0,01224, 2500 = 0,01063 (USD); RoHS: Yes; Mount: Surface Mount; Case/Package: 0603; Case Code (Metric): 1608; Case Code (Imperial): 0603; Contact Plating: Tin,Matte; Min Operating Temperature: -55°C; Max Operating Temperature: 155°C; Packaging: Tape and Reel; Resistance: 10kR; Composition: Thin Film; Number of Terminations: 2; Features: Moisture Resistant,Anti-Sulfur; Length: 0.059inch; Height: 0.02inch; Width: 0.031inch; Radiation Hardening: No; Lead Free: Lead Free; ComponentLink1URL: https://www.seielect.com/Catalog/SEI-rncp.pdf?src-supplier=Avnet; ComponentLink1Description: https://www.seielect.com/Catalog/SEI-rncp.pdf?src-supplier=Avnet; ComponentLink2URL: https://www.seielect.com/catalog/SEI-Packaging.pdf?src-supplier=Digi-Key; ComponentLink2Description: https://www.seielect.com/catalog/SEI-Packaging.pdf?src-supplier=Digi-Key; ComponentLink3URL: https://www.seielect.com/Catalog/SEI-rncp.pdf?src-supplier=Digi-Key; ComponentLink3Description: https://www.seielect.com/Catalog/SEI-rncp.pdf?src-supplier=Digi-Key

## Nets that join several sheets
3v3: STM32L0 (13 pins), Sensor-Flash (IC3.3 R1.2 R19.2)
GND: STM32L0 (17 pins), Sensor-Flash (5 pins)
Vsensor: STM32L0 (IC4.27 R3.1 R4.1), Sensor-Flash (C1.2 IC1.3)
NetIC1_1: STM32L0 (IC4.29 R3.2), Sensor-Flash (IC1.1)
NetIC1_2: STM32L0 (IC4.28), Sensor-Flash (IC1.2)
NetIC1_6: STM32L0 (IC4.30 R4.2), Sensor-Flash (IC1.6)
NetIC2_1: STM32L0 (IC4.10), Sensor-Flash (IC2.1 R1.1)
NetIC2_2: STM32L0 (IC4.12), Sensor-Flash (IC2.2)
NetIC2_3: STM32L0 (IC4.9), Sensor-Flash (IC2.3)
NetIC2_5: STM32L0 (IC4.13), Sensor-Flash (IC2.5)
NetIC2_6: STM32L0 (IC4.11), Sensor-Flash (IC2.6)
NetIC2_7: STM32L0 (IC4.14), Sensor-Flash (IC2.7)
NetIC3_1: STM32L0 (IC4.15), Sensor-Flash (IC3.1 R19.1)